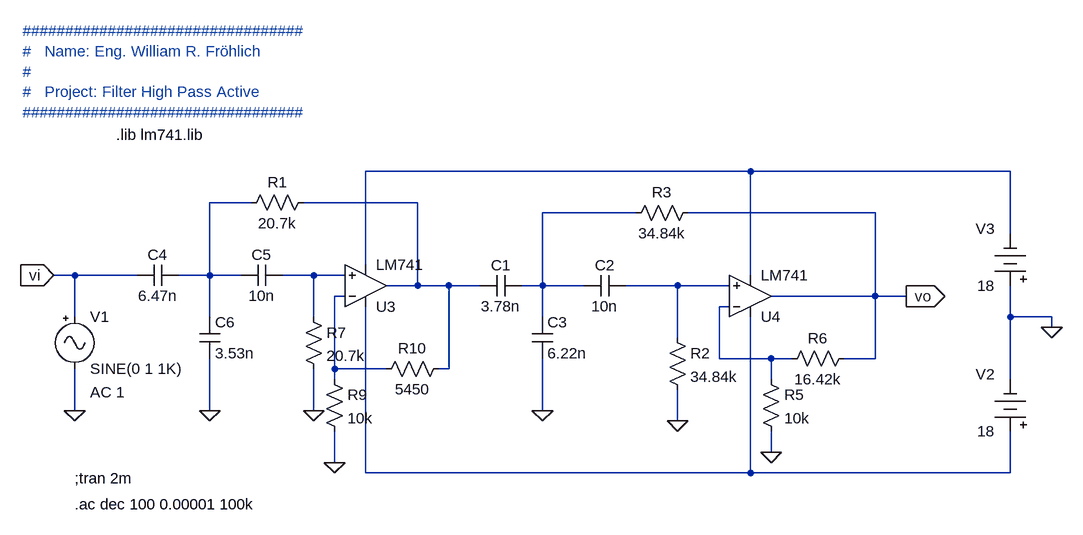
[diagram p0: schematic Filter_High_Pass_Active02.asc]
Filter_High_Pass_Active02.asc, the LTspice schematic file:
Version 4
SHEET 1 1156 680
WIRE 672 0 80 0
WIRE 1072 0 672 0
WIRE -96 48 -160 48
WIRE 160 48 -16 48
WIRE 496 64 352 64
WIRE 864 64 576 64
WIRE 1072 96 1072 0
WIRE 80 144 80 0
WIRE -368 160 -400 160
WIRE -272 160 -368 160
WIRE -160 160 -160 48
WIRE -160 160 -208 160
WIRE -112 160 -160 160
WIRE 0 160 -48 160
WIRE 48 160 0 160
WIRE 672 160 672 0
WIRE 160 176 160 48
WIRE 160 176 112 176
WIRE 208 176 160 176
WIRE 256 176 208 176
WIRE 352 176 352 64
WIRE 352 176 320 176
WIRE 416 176 352 176
WIRE 560 176 480 176
WIRE 640 176 560 176
WIRE 48 192 32 192
WIRE 864 192 864 64
WIRE 864 192 704 192
WIRE 912 192 864 192
WIRE 640 208 624 208
WIRE -368 224 -368 160
WIRE -160 224 -160 160
WIRE 0 224 0 160
WIRE 352 224 352 176
WIRE 1072 224 1072 176
WIRE 1136 224 1072 224
WIRE 1136 240 1136 224
WIRE 560 256 560 176
WIRE 624 288 624 208
WIRE 704 288 624 288
WIRE 736 288 704 288
WIRE 864 288 864 192
WIRE 864 288 816 288
WIRE 32 304 32 192
WIRE 112 304 32 304
WIRE 208 304 208 176
WIRE 208 304 192 304
WIRE 32 320 32 304
WIRE 704 320 704 288
WIRE 1072 320 1072 224
WIRE -368 368 -368 304
WIRE -160 368 -160 288
WIRE 0 368 0 304
WIRE 352 368 352 288
WIRE 560 384 560 336
WIRE 704 432 704 400
WIRE 32 448 32 400
WIRE 80 464 80 208
WIRE 672 464 672 224
WIRE 672 464 80 464
WIRE 1072 464 1072 400
WIRE 1072 464 672 464
FLAG 0 368 0
FLAG -368 368 0
FLAG 352 368 0
FLAG 560 384 0
FLAG -400 160 vi
IOPIN -400 160 In
FLAG 912 192 vo
IOPIN 912 192 Out
FLAG 704 432 0
FLAG 1136 240 0
FLAG -160 368 0
FLAG 32 448 0
SYMBOL Misc\\signal -368 208 R0
WINDOW 123 24 132 Left 2
WINDOW 39 0 0 Left 2
SYMATTR Value2 AC 1
SYMATTR InstName V1
SYMBOL res 688 304 R0
SYMATTR InstName R5
SYMATTR Value 10k
SYMBOL res 832 272 R90
WINDOW 0 0 56 VBottom 2
WINDOW 3 32 56 VTop 2
SYMATTR InstName R6
SYMATTR Value 16.42k
SYMBOL Misc\\battery 1072 416 R180
WINDOW 0 24 104 Left 2
WINDOW 3 24 16 Left 2
WINDOW 123 0 0 Left 2
WINDOW 39 0 0 Left 2
SYMATTR InstName V2
SYMATTR Value 18
SYMBOL Misc\\battery 1072 192 R180
WINDOW 0 24 104 Left 2
WINDOW 3 24 16 Left 2
WINDOW 123 0 0 Left 2
WINDOW 39 0 0 Left 2
SYMATTR InstName V3
SYMATTR Value 18
SYMBOL res 16 304 R0
SYMATTR InstName R9
SYMATTR Value 10k
SYMBOL res 208 288 R90
WINDOW 0 0 56 VBottom 2
WINDOW 3 32 56 VTop 2
SYMATTR InstName R10
SYMATTR Value 5450
SYMBOL cap -208 144 R90
WINDOW 0 0 32 VBottom 2
WINDOW 3 32 32 VTop 2
SYMATTR InstName C4
SYMATTR Value 6.47n
SYMBOL cap -48 144 R90
WINDOW 0 0 32 VBottom 2
WINDOW 3 32 32 VTop 2
SYMATTR InstName C5
SYMATTR Value 10n
SYMBOL cap -176 224 R0
SYMATTR InstName C6
SYMATTR Value 3.53n
SYMBOL res 0 32 R90
WINDOW 0 0 56 VBottom 2
WINDOW 3 32 56 VTop 2
SYMATTR InstName R1
SYMATTR Value 20.7k
SYMBOL res -16 208 R0
SYMATTR InstName R7
SYMATTR Value 20.7k
SYMBOL cap 320 160 R90
WINDOW 0 0 32 VBottom 2
WINDOW 3 32 32 VTop 2
SYMATTR InstName C1
SYMATTR Value 3.78n
SYMBOL cap 480 160 R90
WINDOW 0 0 32 VBottom 2
WINDOW 3 32 32 VTop 2
SYMATTR InstName C2
SYMATTR Value 10n
SYMBOL cap 336 224 R0
SYMATTR InstName C3
SYMATTR Value 6.22n
SYMBOL res 544 240 R0
SYMATTR InstName R2
SYMATTR Value 34.84k
SYMBOL res 592 48 R90
WINDOW 0 0 56 VBottom 2
WINDOW 3 32 56 VTop 2
SYMATTR InstName R3
SYMATTR Value 34.84k
SYMBOL Opamps\\opamp2 80 240 M180
SYMATTR InstName U3
SYMATTR Value LM741
SYMBOL Opamps\\opamp2 672 256 M180
SYMATTR InstName U4
SYMATTR Value LM741
TEXT -368 472 Left 2 !;tran 2m
TEXT -368 512 Left 2 !.ac dec 100 0.00001 100k
TEXT -304 -56 Left 2 !.lib lm741.lib
TEXT -448 -216 Left 2 ;#################################\n#   Name: Eng. William R. Fröhlich\n#\n#   Project: Filter High Pass Active\n#################################

The netlist it stands for:
* Filter_High_Pass_Active02.asc
V1 vi 0 SINE(0 1 1K) AC 1
R5 N008 0 10k
R6 vo N008 16.42k
V2 N009 0 18
V3 0 N001 18
R9 N007 0 10k
R10 N003 N007 5450
C4 N002 vi 6.47n
C5 N005 N002 10n
C6 N002 0 3.53n
R1 N003 N002 20.7k
R7 N005 0 20.7k
C1 N004 N003 3.78n
C2 N006 N004 10n
C3 N004 0 6.22n
R2 N006 0 34.84k
R3 vo N004 34.84k
XU3 N005 N007 N009 N001 N003 LM741  ; pins In+ In- V+ V- OUT
XU4 N006 N008 N009 N001 vo LM741  ; pins In+ In- V+ V- OUT
;tran 2m
.ac dec 100 0.00001 100k
.lib lm741.lib
* #################################
* #   Name: Eng. William R. Fröhlich
* #
* #   Project: Filter High Pass Active
* #################################
.backanno
.end